# EasyEDA Pro project can-mcu.eprj, board host-dev
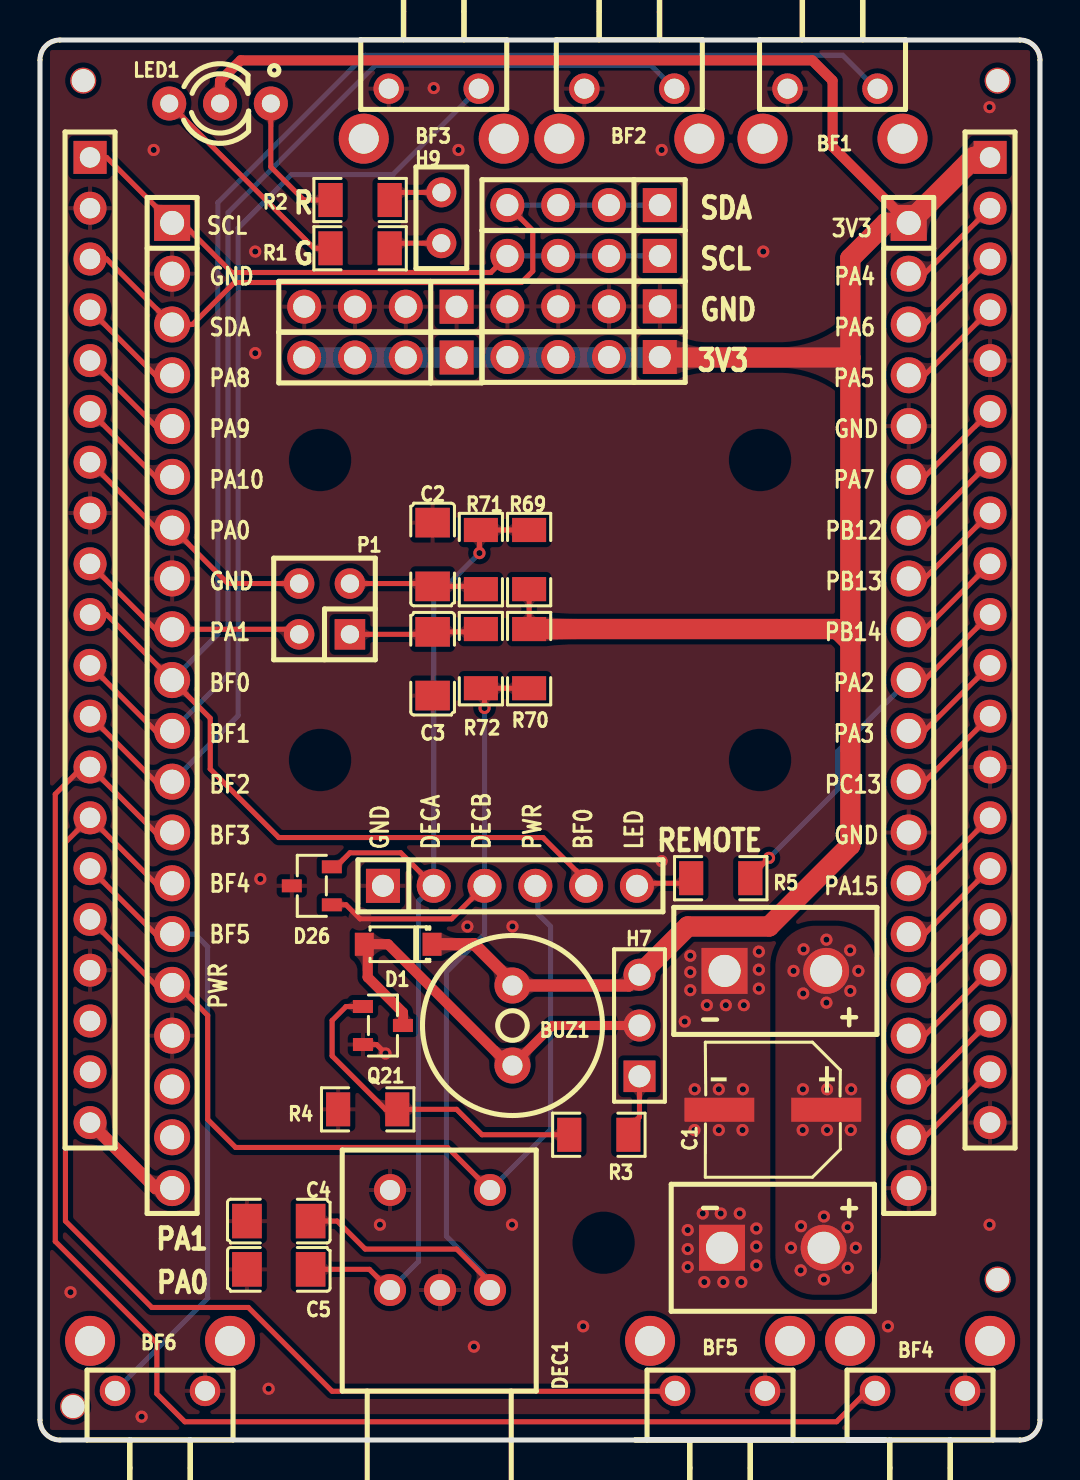
[diagram p11: board, top side]
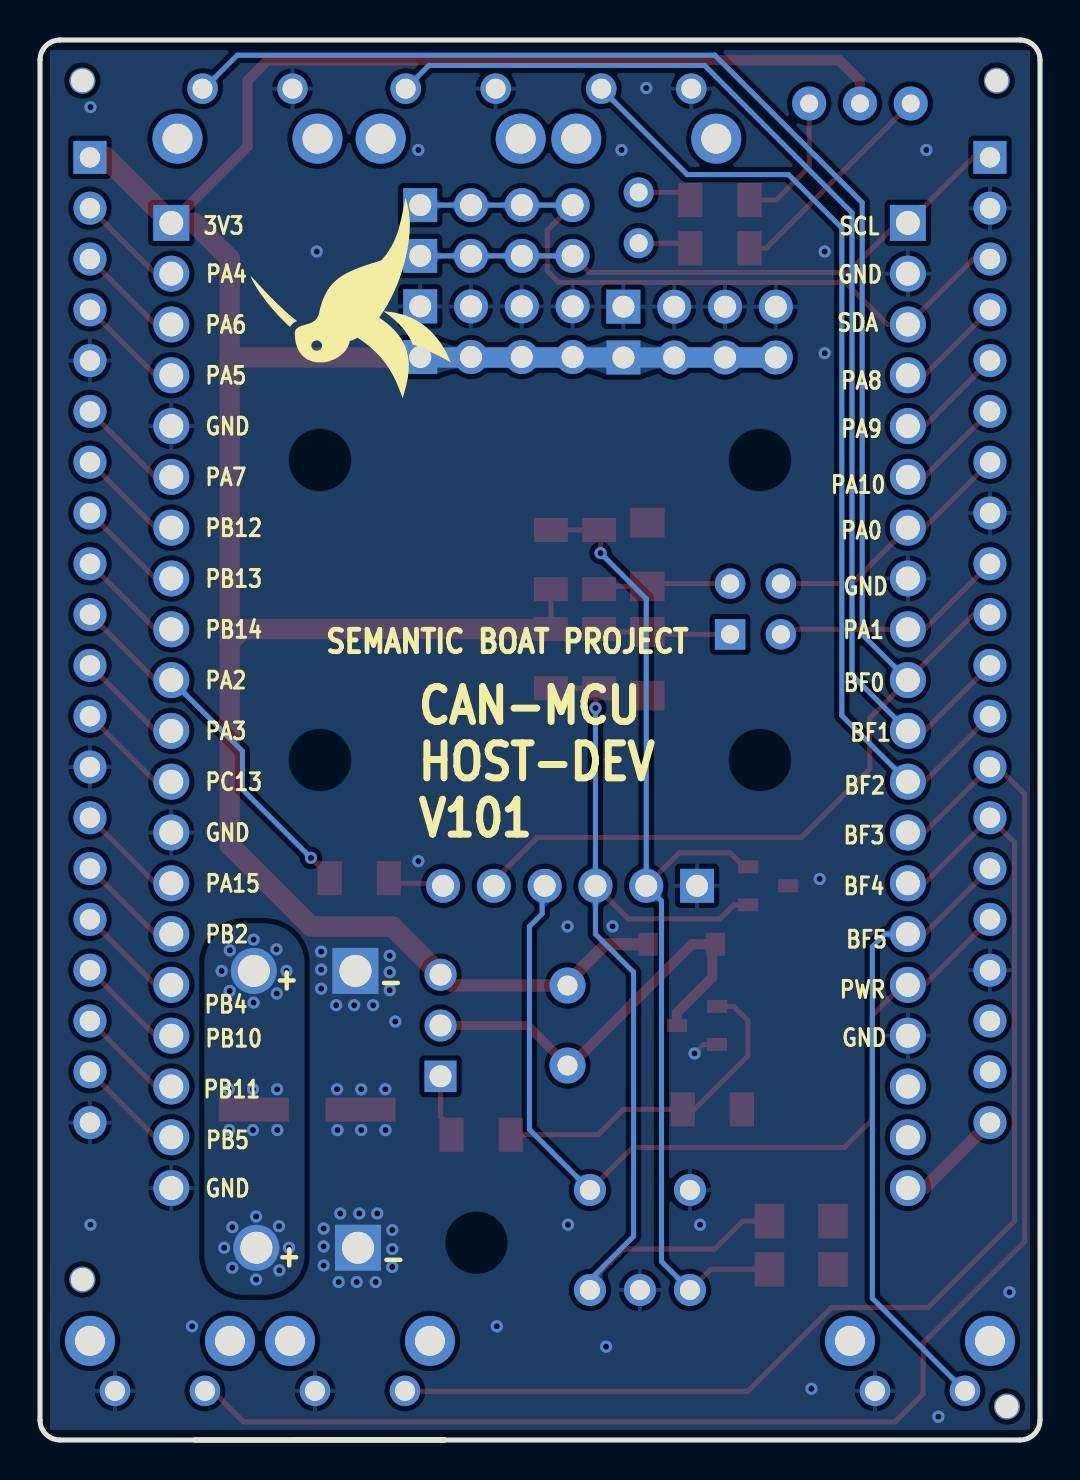
[diagram p12: board, bottom side, seen from below]

Outline 50 x 70 mm; copper layers: Top Layer, Bottom Layer. Coordinates in mm from the lower left corner of the outline.
Outline path: 1,0 arc(0.29,0.29) 0,1 0,69 arc(0.29,69.71) 1,70 49,70 arc(49.71,69.71) 50,69 50,1 arc(49.71,0.29) 49,0 29.76,0 42.26,0 1.02,0
Stack: Top Layer 0.035mm / Dielectric1 1.51mm FR4 er 4.5 / Bottom Layer 0.035mm

## Design rules (mm)
template: JLCPCB Capability(Two Layers Board)
spacing copperThickness1oz (default): track to track 0.102, other pairs 0.152 to 0.3
spacing copperThickness2oz: track to track 0.203, other pairs 0.152 to 0.3
track width copperThickness1oz (default): min 0.127, default 0.254, max 2.54
track width copperThickness2oz: min 0.203, default 0.254, max 2.54
differential pair differentialPair (default): width min 0.127, default 0.254, max 2.54; gap min 0.152, default 0.152
via viaSize (default): diameter min 0.5, default 0.61, max 10; hole min 0.3, default 0.305, max 6.3

## Placement (name value [footprint] x y rotation side)
BF1  TC-6615-8-260G  [SW-TH_4P-L7.5-W8.0-P4.50]  39.63 66.32 0 top
BF2  TC-6615-8-260G  [SW-TH_4P-L7.5-W8.0-P4.50]  29.47 66.32 0 top
BF3  TC-6615-8-260G  [SW-TH_4P-L7.5-W8.0-P4.50]  19.69 66.32 0 top
BF4  TC-6615-8-260G  [SW-TH_4P-L7.5-W8.0-P4.50]  44 3.71 180 top
BF5  TC-6615-8-260G  [SW-TH_4P-L7.5-W8.0-P4.50]  34 3.71 180 top
BF6  TC-6615-8-260G  [SW-TH_4P-L7.5-W8.0-P4.50]  6 3.71 180 top
BUZ1  2.7kHz  [BUZ-TH_BD9.0-P4.00-D0.6-FD]  23.62 20.72 270 top
C1  100uF  [CAP-SMD_BD6.3-L6.6-W6.6-LS7.3-FD-H7.7]  36.64 16.51 180 top
C2  10nF  [C1206]  19.63 44.28 270 top
C3  10nF  [C1206]  19.63 38.81 90 top
C4  10nF  [C1206]  11.94 10.94 0 top
C5  10nF  [C1206]  11.94 8.53 0 top
D1  1N4148W  [SOD-123_L2.8-W1.8-LS3.7-RD]  17.91 24.79 180 top
D26  PESD3V3S2UT  [SOT-23-3_L2.9-W1.3-P1.90-LS2.4-BR]  13.59 27.71 0 top
DEC1  PEC09-2120K-T0012  [SW-TH_PEC09-2120K-T0012]  20 10 270 top
H1  PZ254V-11-04P  [HDR-TH_4P-P2.54-V-M]  27.18 54.15 180 top
H2  PZ254V-11-04P  [HDR-TH_4P-P2.54-V-M]  27.18 56.68 180 top
H3  PZ254V-11-04P  [HDR-TH_4P-P2.54-V-M]  27.18 59.2 180 top
H4  PZ254V-11-04P  [HDR-TH_4P-P2.54-V-M]  17.02 54.12 180 top
H5  PZ254V-11-04P  [HDR-TH_4P-P2.54-V-M]  17.02 56.67 180 top
H6  PZ254V-11-04P  [HDR-TH_4P-P2.54-V-M]  27.18 61.75 180 top
H7  2.54-1*3P针  [HDR-TH_3P-P2.54-V-M-1]  29.97 20.72 90 top
H8  PZ254V-11-06P  [HDR-TH_6P-P2.54-V-M]  23.5 27.71 0 top
H9  PH2.54-1X2P-H25  [HDR-TH_2P-P2.54-V-M-4]  20.07 61.11 270 top
J1  2.54-1*20P直针  [HDR-TH_20P-P2.54-V-M-1]  43.44 36.73 270 top
J2  2.54-1*20P直针  [HDR-TH_20P-P2.54-V-M-1]  6.61 36.73 270 top
LED1  TZ-LAMP03RG4HD-A  [LED-TH_3P-BD3.9-P2.54-R-BI]  9 66.83 0 top
NOREF  -  [Pad_e3266]  47.88 67.97 270 top
NOREF#2  -  [Pad_e3265]  1.65 1.67 270 top
NOREF#3  -  [Pad_e3263]  2.16 67.97 270 top
NOREF#4  -  [Pad_e3264]  47.88 8.02 270 top
P1  2.54-2*2P针  [HDR-TH_4P-P2.54-V-M-R2-C2-S2.54-1]  14.23 41.55 90 top
Q21  AO3400A  [SOT-23-3_L2.9-W1.3-P1.90-LS2.4-BR]  17.15 20.72 180 top
R1  100Ω  [R1206]  16 59.59 180 top
R2  270Ω  [R1206]  16 62 180 top
R3  220Ω  [R1206]  27.94 15.26 180 top
R4  47kΩ  [R1206]  16.39 16.53 0 top
R5  300Ω  [R1206]  34.04 28.09 0 top
R69  10kΩ  [R1206]  24.46 44.02 270 top
R70  10kΩ  [R1206]  24.46 39.07 90 top
R71  1kΩ  [R1206]  22.04 44.02 270 top
R72  1kΩ  [R1206]  22.04 39.07 90 top
U1  PZ508V-11-02P-H25  [HDR-TH_2P-P5.08-V-M]  36.64 9.61 0 top
U2  PZ508V-11-02P-H25  [HDR-TH_2P-P5.08-V-M]  36.77 23.45 0 top
U3  KH-2.54FH-1X20P-H8.5  [HDR-TH_20P-P2.54-V-F-2]  47.5 40 270 top
U4  KH-2.54FH-1X20P-H8.5  [HDR-TH_20P-P2.54-V-F-2]  2.5 40 270 top

## Footprints (pads in the part's own frame, mm; a bottom-side part is the same pattern mirrored in y, then rotated)
BUZ-TH_BD9.0-P4.00-D0.6-FD
  round 1.8 hole 1: 1(-2,0) 2(2,0)
C1206
  rect 1.485x1.728 smd: 1(-1.593,0) 2(1.593,0)
CAP-SMD_BD6.3-L6.6-W6.6-LS7.3-FD-H7.7
  rect 3.5x1.2 smd: 1(-2.67,0) 2(2.67,0)
HDR-TH_2P-P2.54-V-M-4
  round 1.5 hole 0.9: 1(-1.27,0) 2(1.27,0)
HDR-TH_2P-P5.08-V-M
  rect 2.3x2.3 hole 1.6: 1(-2.54,0)
  round 2.3 hole 1.6: 2(2.54,0)
HDR-TH_3P-P2.54-V-M-1
  rect 1.575x1.6 hole 1.1: 1(-2.54,0)
  round 1.6 hole 1.1: 2(0,0) 3(2.54,0)
HDR-TH_4P-P2.54-V-M
  rect 1.7x1.7 hole 1.1: 1(-3.81,0)
  round 1.7 hole 1.1: 2(-1.27,0) 3(1.27,0) 4(3.81,0)
HDR-TH_4P-P2.54-V-M-R2-C2-S2.54-1
  rect 1.524x1.524 hole 0.914: 1(-1.27,-1.27)
  round 1.524 hole 0.914: 2(-1.27,1.27) 3(1.27,-1.27) 4(1.27,1.27)
HDR-TH_6P-P2.54-V-M
  rect 1.7x1.7 hole 1.1: 1(-6.35,0)
  round 1.7 hole 1.1: 2(-3.81,0) 3(-1.27,0) 4(1.27,0) 5(3.81,0) 6(6.35,0)
HDR-TH_20P-P2.54-V-F-2
  rect 1.65x1.65 hole 1.02: 1(-24.13,0)
  round 1.65 hole 1.02: 2(-21.59,0) 3(-19.05,0) 4(-16.51,0) 5(-13.97,0) 6(-11.43,0) 7(-8.89,0) 8(-6.35,0) 9(-3.81,0) 10(-1.27,0) 11(1.27,0) 12(3.81,0) 13(6.35,0) 14(8.89,0) 15(11.43,0) 16(13.97,0) 17(16.51,0) 18(19.05,0) 19(21.59,0) 20(24.13,0)
HDR-TH_20P-P2.54-V-M-1
  rect 1.8x1.8 hole 1.2: 1(-24.13,0)
  round 1.8 hole 1.2: 2(-21.59,0) 3(-19.05,0) 4(-16.51,0) 5(-13.97,0) 6(-11.43,0) 7(-8.89,0) 8(-6.35,0) 9(-3.81,0) 10(-1.27,0) 11(1.27,0) 12(3.81,0) 13(6.35,0) 14(8.89,0) 15(11.43,0) 16(13.97,0) 17(16.51,0) 18(19.05,0) 19(21.59,0) 20(24.13,0)
LED-TH_3P-BD3.9-P2.54-R-BI
  round 1.7 hole 0.9: 1(2.54,0) 2(0,0) 3(-2.54,0)
Pad_e3263
  round 1.3 hole 1.152: 1(0,0)
Pad_e3264
  round 1.3 hole 1.152: 1(0,0)
Pad_e3265
  round 1.3 hole 1.152: 1(0,0)
Pad_e3266
  round 1.3 hole 1.152: 1(0,0)
R1206
  rect 1.208x1.701 smd: 1(-1.479,0) 2(1.479,0)
SOD-123_L2.8-W1.8-LS3.7-RD
  rect 0.95x1.15 smd: 1(-1.692,0) 2(1.692,0)
SOT-23-3_L2.9-W1.3-P1.90-LS2.4-BR
  rect 1x0.65 smd: 1(1,-0.95) 2(1,0.95) 3(-1,0)
SW-TH_4P-L7.5-W8.0-P4.50
  round 1.524 hole 1: 1(-2.25,1.25) 2(2.25,1.25)
  round 2.5 hole 1.5: 3(-3.5,-1.25) 4(3.5,-1.25)
SW-TH_PEC09-2120K-T0012
  round 1.6 hole 1: A(2.5,-2.5) B(2.5,0) C(2.5,2.5) D(-2.5,-2.5) E(-2.5,2.5)

## Nets
As in the schematic.

Pads without a net: BF1 3 4; BF2 3 4; BF3 3 4; BF4 3 4; BF5 3 4; BF6 3 4; J2 18 19; NOREF 1; NOREF#2 1; NOREF#3 1; NOREF#4 1; U4 18 19

## Via types
v1: diameter 0.61, hole 0.305, Top Layer to Bottom Layer, 75 vias

## Routing (per net, layer and track width the routed paths; a pad name or vN(x,y) marks a point on that pad's centre or on a via; arc(x,y) is an arc through that point)
+3V3: length 150.2
  Top Layer w0.254: R70.2 24.46,42.54
  Top Layer w0.508: J1.1 39.63,64.67 39.63,67.97 38.61,68.98 10.04,68.98 9,67.95 LED1.2
  Top Layer w0.61: D1.1 21.72,24.79 23.78,22.72 ; 23.78,22.72 BUZ1.1 ; 23.78,22.72 29.43,22.72 H7.3
  Top Layer w1.016: H1.1 31.01,54.12 40.52,54.12 ; 40.52,54.12 40.52,39.9 ; 40.52,54.12 40.52,59.08 42.29,60.86 J1.1 ; 40.52,39.9 39.87,40.55 R70.2 ; 40.52,39.9 40.52,29.74 36.45,25.68 32.39,25.68 H7.3
  Top Layer w1.067: J1.1 46.71,64.13 U3.1
  Bottom Layer w1.016: H1.1 30.97,54.12 H4.1 H4.2 H4.3 H4.4
+12V:
  vias: v1(37.55,9.61) v1(37.68,23.45) v1(38.05,10.69) v1(38.03,8.48) v1(38.15,17.54) v1(38.14,15.5) v1(38.18,24.53) v1(38.16,22.33) v1(39.2,11.17) v1(39.2,8.02) v1(39.32,25.02) v1(39.32,21.87) v1(39.35,17.54) v1(39.35,15.5) v1(40.38,10.64) v1(40.39,8.61) v1(40.51,24.48) v1(40.52,22.45) v1(40.54,15.5) v1(40.56,17.54) v1(40.79,9.61) v1(40.92,23.45)
+12V_H: length 5.5
  Top Layer w0.61: J2.20 5.78,12.6 U4.20
GND: length 1.3
  Top Layer w0.254: Q21.2 16.83,19.77 v1(17.27,19.33)
  vias: v1(1.53,7.39) v1(5.08,1.17) v1(5.68,64.5) v1(10.76,59.42) v1(10.76,54.34) v1(11.02,28.05) v1(11.43,2.56) v1(17,10.76) v1(19.69,67.6) v1(20.92,64.5) v1(21.37,25.68) v1(21.7,4.67) v1(23.62,25.68) v1(23.6,10.76) v1(27.16,5.68) v1(31.08,64.5) v1(31.08,28.94) v1(32.24,20.92) v1(32.39,10.5) v1(32.39,9.55) v1(32.39,8.65) v1(32.51,24.21) v1(32.51,23.39) v1(32.51,22.49) v1(32.73,17.54) v1(32.72,15.5) v1(33.14,11.33) v1(33.22,7.9) v1(33.34,21.74) v1(33.94,17.54) v1(33.94,15.5) v1(34.04,11.33) v1(34.17,7.9) v1(34.29,21.74) v1(34.99,11.33) v1(35.15,17.54) v1(35.13,15.5) v1(35.07,7.9) v1(35.19,21.74) v1(35.82,10.57) v1(35.82,9.68) v1(35.82,8.73) v1(35.94,24.42) v1(35.94,23.52) v1(35.94,22.57) v1(36.16,59.42) v1(42.4,5.68) v1(47.48,66.64) v1(47.48,10.76)
BTN_FUN_0: length 93.5
  Top Layer w0.254: U4.10 3.33,41.27 J2.10 8.51,36.09 8.51,33.55 11.94,30.12 25.15,30.12 27.43,27.84
  Bottom Layer w0.254: 41.81,67.57 40.13,69.24 16.26,69.24 8.89,61.87 8.89,40.28 J2.10
BTN_FUN_1: length 58.4
  Top Layer w0.254: J2.11 5.78,35.46 U4.11
  Bottom Layer w0.254: J2.11 9.4,38.25 9.4,61.36 16.77,68.73 30.55,68.73 BF2.2
BTN_FUN_2: length 49.4
  Top Layer w0.254: U4.12 5.78,32.92 J2.12
  Bottom Layer w0.254: J2.12 9.91,36.22 9.91,60.6 12.58,63.27 17.64,63.27 BF3.2
BTN_FUN_3: length 77
  Top Layer w0.254: BF4.2 41.37,2.46 39.83,0.91 7.24,0.91 5.84,2.31 5.84,4.85 0.76,9.93 0.76,32.29 2.12,33.65 U4.13 5.78,30.38 J2.13
BTN_FUN_4: length 60.1
  Top Layer w0.254: J2.14 5.78,27.84 U4.14 1.27,29.88 1.27,10.94 5.59,6.63 10.42,6.63 14.61,2.44 31.73,2.44 BF5.2
BTN_FUN_5: length 31.6
  Top Layer w0.254: U4.15 5.78,25.3 J2.15
  Bottom Layer w0.254: J2.15 7.75,25.3 8.38,24.66 8.38,7.09 BF6.2
BTN_POWER: length 45.5
  Top Layer w0.254: DEC1.E 20.37,14.63 9.78,14.63 8.38,16.03 8.38,21.23 6.86,22.76 J2.16 5.78,22.76 U4.16
  Bottom Layer w0.254: DEC1.E 25.53,15.53 25.53,25.68 24.89,26.31 24.89,27.84
DEC_A: length 52.8
  Top Layer w0.254: D26.2 14.8,28.66 15.5,29.36 18.04,29.36 H8.2 ; v1(21.97,44.35) 21.97,45.43 R71.1 R69.1 ; DEC1.A 16.47,8.53 C5.2
  Bottom Layer w0.254: v1(21.97,44.35) 19.69,42.06 H8.2 18.93,26.95 18.93,8.92 DEC1.A
DEC_B: length 53.5
  Top Layer w0.254: D26.1 15.3,26.76 16,26.06 20.58,26.06 H8.3 ; R70.1 R72.1 22.23,37.41 v1(22.23,36.6) ; DEC1.C 22.5,7.88 20.83,9.55 16.26,9.55 14.86,10.94 C4.2
  Bottom Layer w0.254: v1(22.23,36.6) H8.3 22.23,25.3 20.32,23.39 20.32,10.18 22.5,8 DEC1.C
GPIO_PA0_T21: length 13
  Top Layer w0.254: P1.4 9.4,42.82 J2.7 5.78,45.62 U4.7
GPIO_PA1_T22: length 11.9
  Top Layer w0.254: P1.2 12.7,40.54 J2.9 5.78,40.54 U4.9
GPIO_PA2_T23: length 18.6
  Top Layer w0.254: J1.10 44.23,38 U3.10 ; v1(36.45,29.11) 35.52,28.17 R5.2
  Bottom Layer w0.254: v1(36.45,29.11) 39.88,32.53 39.88,34.44 J1.10
GPIO_PA3_T24: length 5.4
  Top Layer w0.254: U3.11 44.23,35.46 J1.11
GPIO_PA4_D_CS: length 5.4
  Top Layer w0.254: U3.2 44.23,58.32 J1.2
GPIO_PA5_D_SCK: length 5.4
  Top Layer w0.254: J1.4 44.23,53.24 U3.4
GPIO_PA6_D_DC: length 5.4
  Top Layer w0.254: J1.3 44.23,55.78 U3.3
GPIO_PA7_D_MOSI: length 5.4
  Top Layer w0.254: J1.6 44.23,48.16 U3.6
GPIO_PA8_T11: length 5.5
  Top Layer w0.254: J2.4 5.78,53.24 U4.4
GPIO_PA9_T12: length 5.5
  Top Layer w0.254: J2.5 5.78,50.7 U4.5
GPIO_PA10_T13: length 5.5
  Top Layer w0.254: J2.6 5.78,48.16 U4.6
GPIO_PA15_F1: length 5.4
  Top Layer w0.254: J1.14 44.23,27.84 U3.14
GPIO_PB2_F2: length 5.4
  Top Layer w0.254: U3.15 44.23,25.3 J1.15
GPIO_PB4_F3: length 5.4
  Top Layer w0.254: U3.16 44.23,22.76 J1.16
GPIO_PB5_FP: length 5.4
  Top Layer w0.254: J1.19 44.23,15.14 U3.19
GPIO_PB10_F4: length 5.4
  Top Layer w0.254: U3.17 44.23,20.22 J1.17
GPIO_PB11_F5: length 5.4
  Top Layer w0.254: U3.18 44.23,17.68 J1.18
GPIO_PB12_D_BUSY: length 5.4
  Top Layer w0.254: J1.7 44.23,45.62 U3.7
GPIO_PB13_D_PWR: length 5.4
  Top Layer w0.254: U3.8 44.23,43.08 J1.8
GPIO_PB14_D_RST: length 5.4
  Top Layer w0.254: U3.9 44.23,40.54 J1.9
GPIO_PC13_F0: length 5.4
  Top Layer w0.254: J1.12 44.23,32.92 U3.12
I2C_SCL: length 31.2
  Top Layer w0.254: H3.4 22.54,58.38 9.6,58.38 7.11,60.86 J2.1 3.33,64.13 U4.1
  Bottom Layer w0.254: H3.4 H3.3 H3.2 H3.1
I2C_SDA: length 36
  Top Layer w0.254: U4.3 3.33,59.05 J2.3 7.62,55.78 9.72,57.88 24.07,57.88 24.64,58.44 24.64,60.47 H6.4
  Bottom Layer w0.254: H6.4 H6.3 H6.2 H6.1
$1N3237: length 6.8
  Top Layer w0.254: LED1.1 11.54,63.65 13.19,62 R2.2
$1N3240: length 2.7
  Top Layer w0.254: H9.1 17.86,62.38 17.48,62
$1N3317: length 11.1
  Top Layer w0.254: R1.2 13.7,59.59 LED1.3
$1N3320: length 2.7
  Top Layer w0.254: H9.2 17.74,59.84 17.48,59.59
$1N6097: length 22
  Top Layer w0.457: BUZ1.2 25.62,20.72 H7.2
  Top Layer w0.508: Q21.3 18.15,21.38 16.39,23.14 16.39,24.62 D1.2 17.4,24.79 23.47,18.72 BUZ1.2
$1N6541: length 3.2
  Top Layer w0.254: H7.1 29.97,16.15 29.42,15.6 R3.1
$1N6717: length 17.1
  Top Layer w0.254: Q21.1 15.3,21.67 14.61,20.98 14.61,19.2 17.27,16.53 R4.2 20.83,16.53 22.1,15.26 R3.2
$1N12953: length 2.7
  Top Layer w0.254: R5.1 32.31,27.84 29.97,27.84
$1N16107: length 6.7
  Top Layer w0.254: 22.04,42.54 21.9,42.68 C2.2 19.49,42.82 P1.3
$1N16250: length 6.7
  Top Layer w0.254: P1.1 19.51,40.28 C3.2 21.9,40.41 R72.2

## Copper pours and planes (outline as drawn; the poured copper is in the pictures)
+12V on Top Layer: 36.77,23.71 36.79,24 36.85,24.27 36.95,24.54 37.09,24.79 37.26,25.02 37.46,25.22 37.69,25.39 37.94,25.53 38.21,25.63 38.48,25.69 38.77,25.71 39.79,25.71 40.07,25.69 40.35,25.63 40.62,25.53 40.87,25.39 41.1,25.22 41.3,25.02 41.47,24.79 41.6,24.54 41.7,24.27 41.77,24 41.79,23.71 41.79,9.26 41.77,8.98 41.7,8.7 41.6,8.43 41.47,8.18 41.3,7.95 41.1,7.75 40.87,7.58 40.62,7.44 40.35,7.34 40.07,7.28 39.79,7.26 38.77,7.26 38.48,7.28 38.21,7.34 37.94,7.44 37.69,7.58 37.46,7.75 37.26,7.95 37.09,8.18 36.95,8.43 36.85,8.7 36.79,8.98 36.77,9.26
+12V on Bottom Layer: 36.77,23.84 36.79,24.12 36.85,24.4 36.95,24.67 37.09,24.92 37.26,25.15 37.46,25.35 37.69,25.52 37.94,25.66 38.21,25.76 38.48,25.82 38.77,25.84 39.79,25.84 40.07,25.82 40.35,25.76 40.62,25.66 40.87,25.52 41.1,25.35 41.3,25.15 41.47,24.92 41.6,24.67 41.7,24.4 41.77,24.12 41.79,23.84 41.79,9.26 41.77,8.98 41.7,8.7 41.6,8.43 41.47,8.18 41.3,7.95 41.1,7.75 40.87,7.58 40.62,7.44 40.35,7.34 40.07,7.28 39.79,7.26 38.77,7.26 38.48,7.28 38.21,7.34 37.94,7.44 37.69,7.58 37.46,7.75 37.26,7.95 37.09,8.18 36.95,8.43 36.85,8.7 36.79,8.98 36.77,9.26
GND on Top Layer: -1.14,71.02 51.06,71.02 51.06,-1.12 -1.14,-1.12
GND on Bottom Layer: -0.76,70.51 51.31,70.51 51.31,-0.74 -0.76,-0.74

Small or netless copper shapes (teardrops, artwork), in the pictures only: 142 on Top Layer, 46 on Bottom Layer

## Text on the board
Bottom Silkscreen Layer: BF1 | BF5 | BF2 | GND | BF0 | BF3 | PA1 | PA8 | PA9 | PA0 | PWR | SCL | SDA | PA10 | PB5 | PA6 | PA5 | PA7 | PB12 | PB13 | PB14 | PA2 | PA3 | PC13 | PA15 | PB2 | PB10 | PA4 | PB4 | 3V3 | PB11 | BF4 | - | + | SEMANTIC BOAT PROJECT | CAN-MCU / HOST-DEV / V101
Top Silkscreen Layer: SCL | GND | SDA | BF0 | BF1 | BF2 | BF3 | PA15 | PB14 | PC13 | PB12 | PB13 | 3V3 | PA5 | PA7 | PA2 | PA3 | PA6 | PA4 | PWR | DECA | DECB | LED | PA8 | PA9 | PA10 | PA0 | PA1 | BF5 | BF4 | R | G | REMOTE | - | +
